# EasyEDA Pro project ProPrj_四串锂电池电源_2025-05-16.epro, board PCB1
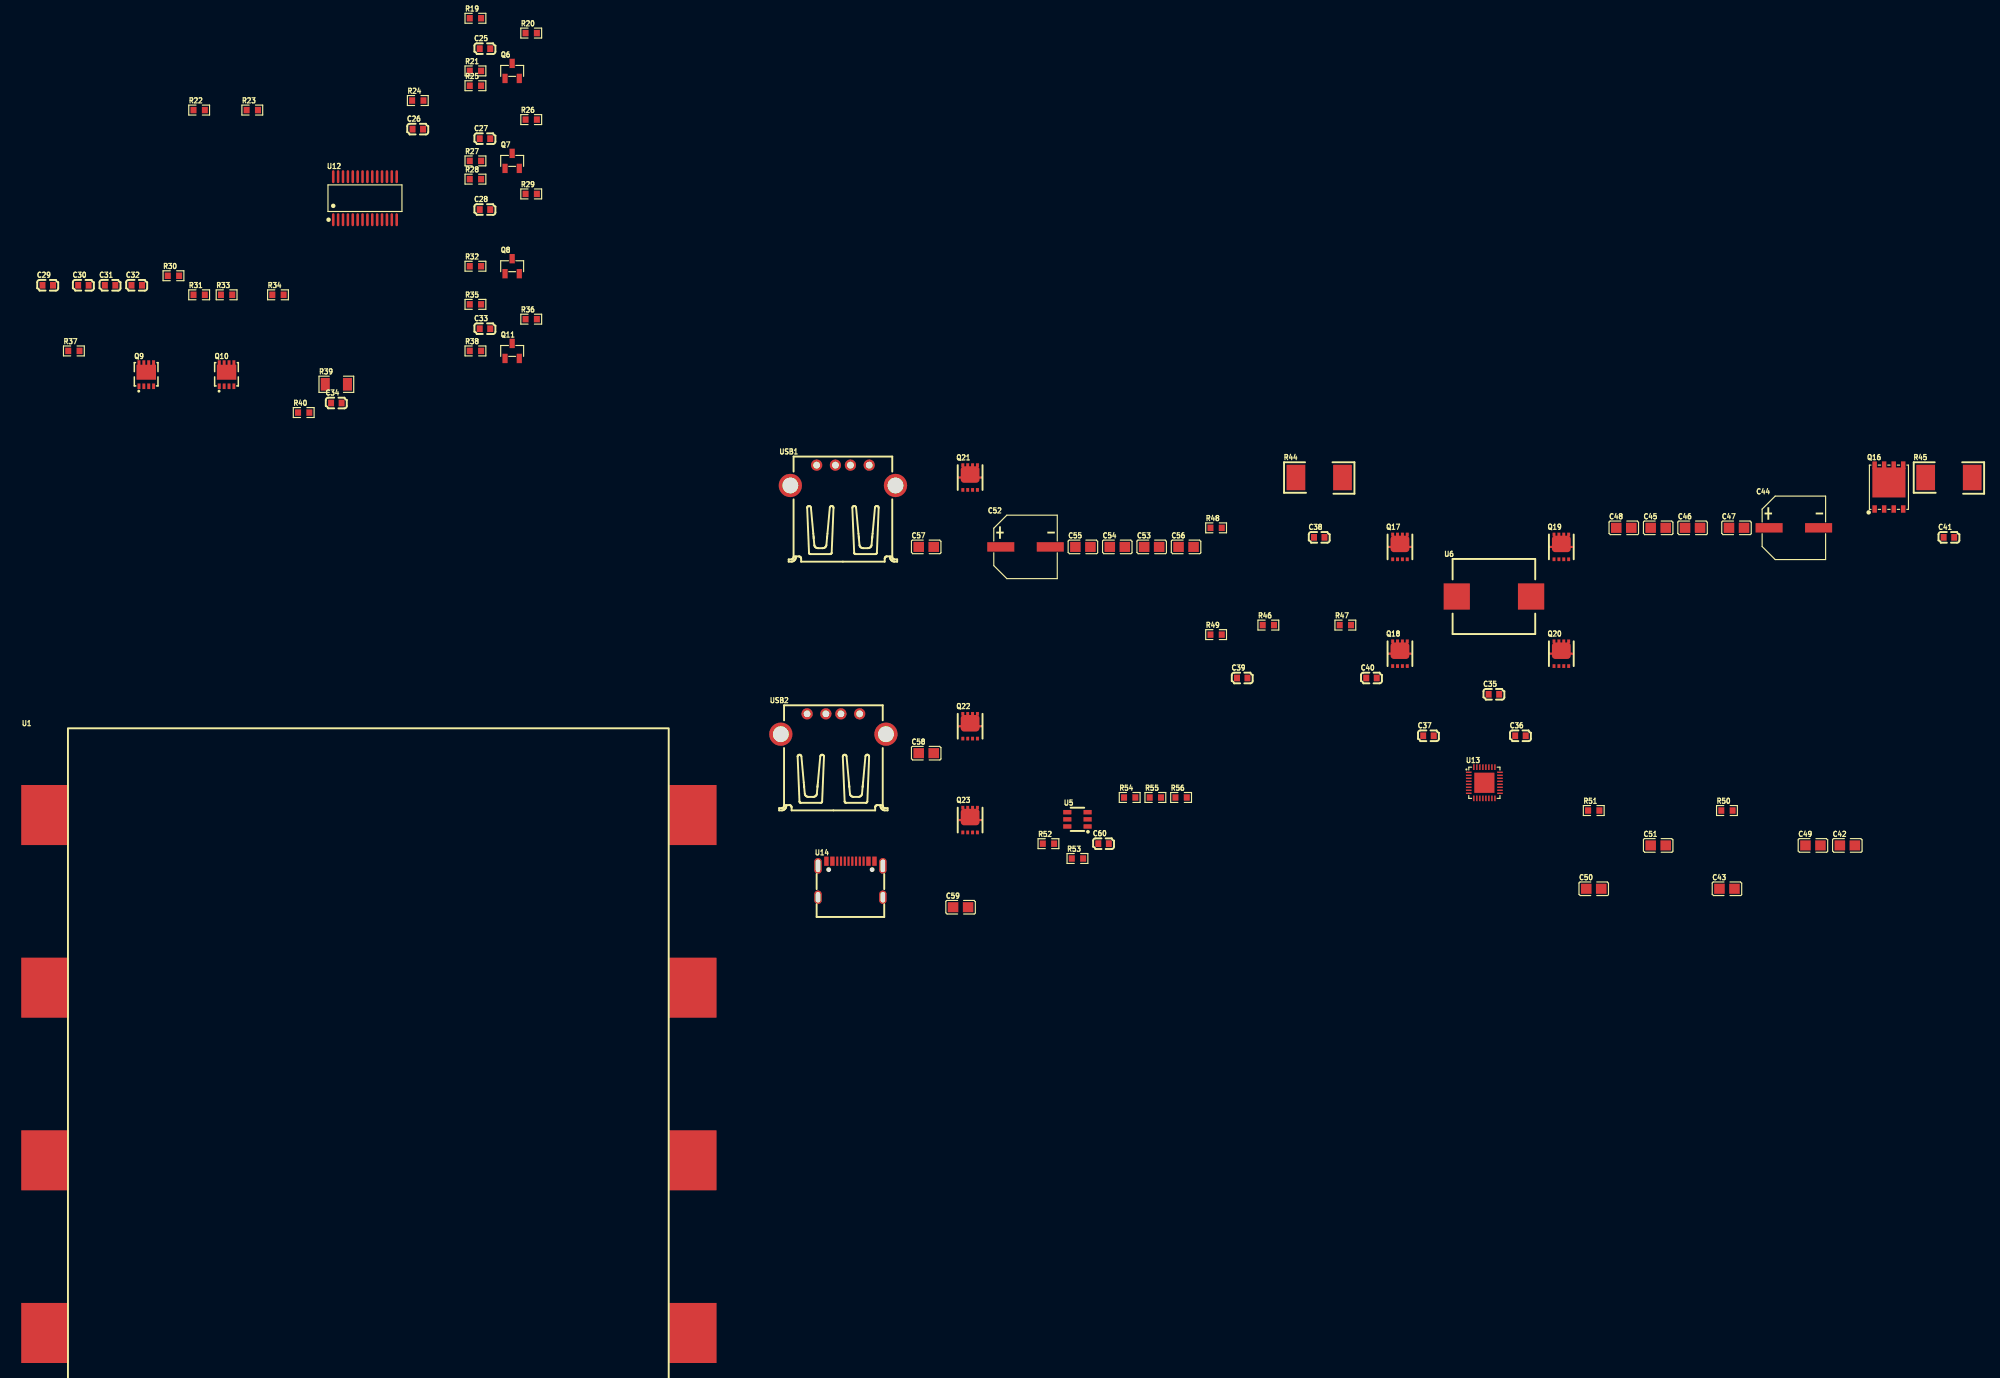
[diagram p8: board, top side]
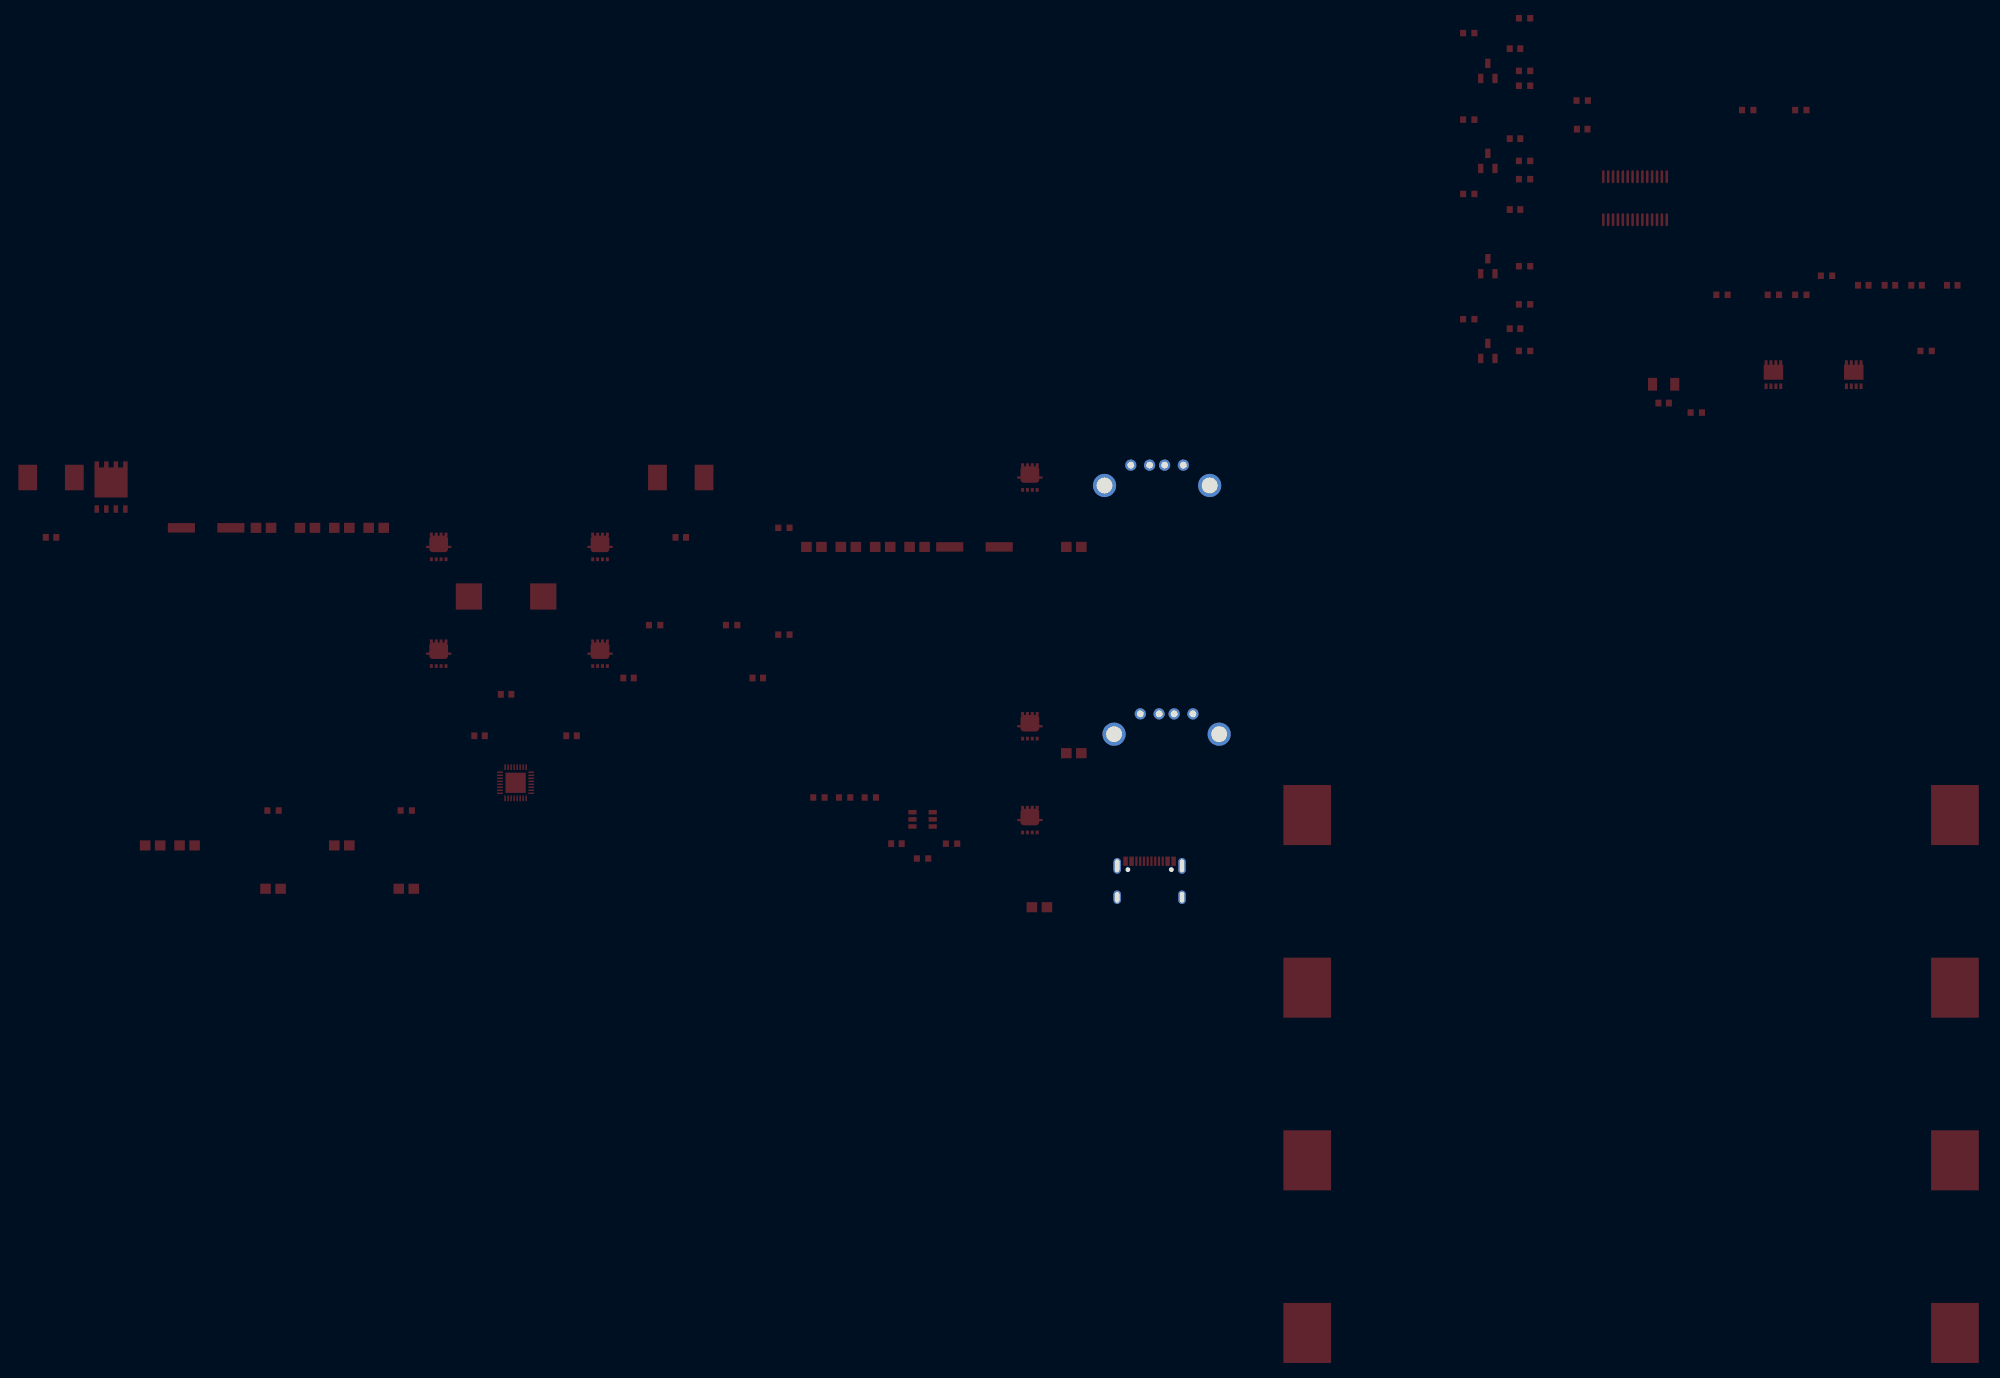
[diagram p9: board, bottom side, seen from below]

Outline 6.43 x 0.64 mm; copper layers: Top Layer, Bottom Layer. Coordinates in mm from the lower left corner of the outline.
Stack: Top Layer 0.035mm / Dielectric1 1.51mm FR4 er 4.5 / Bottom Layer 0.035mm

## Design rules (mm)
template: JLCPCB Capability(Two Layers Board)
spacing copperThickness1oz (default): track to track 0.102, other pairs 0.152 to 0.3
spacing copperThickness2oz: track to track 0.203, other pairs 0.152 to 0.3
track width copperThickness1oz (default): min 0.127, default 0.254, max 2.54
track width copperThickness2oz: min 0.203, default 0.254, max 2.54
differential pair differentialPair (default): width min 0.127, default 0.254, max 2.54; gap min 0.152, default 0.152
via viaSize (default): diameter min 0.5, default 0.61, max 10; hole min 0.3, default 0.305, max 6.3

## Placement (name value [footprint] x y rotation side)
C25  100nF  [C0603]  -45.44 109.69 0 top
C26  10uF  [C0603]  -54.39 98.97 0 top
C27  100nF  [C0603]  -45.44 97.7 0 top
C28  100nF  [C0603]  -45.44 88.26 0 top
C29  100nF  [C0603]  -103.67 78.17 0 top
C30  100nF  [C0603]  -98.92 78.17 0 top
C31  100nF  [C0603]  -95.37 78.17 0 top
C32  100nF  [C0603]  -91.82 78.17 0 top
C33  100nF  [C0603]  -45.44 72.39 0 top
C34  10nF  [C0603]  -65.23 62.48 0 top
C35  10uF  [C0603]  88.91 23.68 0 top
C36  100nF  [C0603]  92.45 18.15 0 top
C37  100nF  [C0603]  80.19 18.15 0 top
C38  100nF  [C0603]  65.65 44.59 0 top
C39  33nF  [C0603]  55.4 25.85 0 top
C40  33nF  [C0603]  72.61 25.85 0 top
C41  100nF  [C0603]  149.5 44.59 0 top
C42  10uF  [C0805]  135.97 3.54 0 top
C43  4.7nF  [C0805]  119.95 -2.23 0 top
C44  220uF  [CAP-SMD_BD8.0-L8.3-W8.3-LS9.0-FD]  128.86 45.86 0 top
C45  22uF  [C0805]  110.79 45.86 0 top
C46  22uF  [C0805]  115.37 45.86 0 top
C47  22uF  [C0805]  121.22 45.86 0 top
C48  22uF  [C0805]  106.21 45.86 0 top
C49  16pF  [C0805]  131.4 3.54 0 top
C50  4.7nF  [C0805]  102.21 -2.23 0 top
C51  8pF  [C0805]  110.79 3.54 0 top
C52  220uF  [CAP-SMD_BD8.0-L8.3-W8.3-LS9.0-FD]  26.54 43.32 0 top
C53  22uF  [C0805]  43.34 43.32 0 top
C54  22uF  [C0805]  38.76 43.32 0 top
C55  22uF  [C0805]  34.18 43.32 0 top
C56  22uF  [C0805]  47.92 43.32 0 top
C57  10uF  [C0805]  13.31 43.32 0 top
C58  10uF  [C0805]  13.31 15.84 0 top
C59  10uF  [C0805]  17.89 -4.69 0 top
C60  100nF  [C0603]  36.93 3.78 0 top
Q6  2N7002K  [SOT-23-3_L2.9-W1.3-P1.90-LS2.4-BL-1]  -41.82 106.73 0 top
Q7  2N7002K  [SOT-23-3_L2.9-W1.3-P1.90-LS2.4-BL-1]  -41.82 94.74 0 top
Q8  2N7002K  [SOT-23-3_L2.9-W1.3-P1.90-LS2.4-BL-1]  -41.82 80.71 0 top
Q9  RU3030M2  [PDFN3333-8_L3.1-W3.2-P0.65-LS3.4-BL]  -90.55 66.25 0 top
Q10  RU3030M2  [PDFN3333-8_L3.1-W3.2-P0.65-LS3.4-BL]  -79.85 66.25 0 top
Q11  2N7002K  [SOT-23-3_L2.9-W1.3-P1.90-LS2.4-BL-1]  -41.82 69.42 0 top
Q16  HY12P03C2  [DFN-8_L5.9-W5.2-P1.27-LS6.2-BL]  141.51 51.29 0 top
Q17  TPN2R703NL  [TSON3x3]  76.4 43.32 0 top
Q18  TPN2R703NL  [TSON3x3]  76.4 29.09 0 top
Q19  TPN2R703NL  [TSON3x3]  97.89 43.32 0 top
Q20  TPN2R703NL  [TSON3x3]  97.89 29.09 0 top
Q21  TPN2R703NL  [TSON3x3]  19.16 52.56 0 top
Q22  TPN2R703NL  [TSON3x3]  19.16 19.42 0 top
Q23  TPN2R703NL  [TSON3x3]  19.16 6.92 0 top
R19  470Ω  [R0603]  -46.71 113.74 0 top
R20  100Ω  [R0603]  -39.28 111.77 0 top
R21  1MΩ  [R0603]  -46.71 106.73 0 top
R22  1MΩ  [R0603]  -83.5 101.51 0 top
R23  1MΩ  [R0603]  -76.43 101.51 0 top
R24  470Ω  [R0603]  -54.39 102.78 0 top
R25  470Ω  [R0603]  -46.71 104.76 0 top
R26  100Ω  [R0603]  -39.28 100.24 0 top
R27  1MΩ  [R0603]  -46.71 94.74 0 top
R28  470Ω  [R0603]  -46.71 92.31 0 top
R29  100Ω  [R0603]  -39.28 90.34 0 top
R30  SDNT1608X103F3380FTF  [R0603]  -86.93 79.44 0 top
R31  6.98kΩ  [R0603]  -83.5 76.9 0 top
R32  1MΩ  [R0603]  -46.71 80.71 0 top
R33  47kΩ  [R0603]  -79.85 76.9 0 top
R34  470Ω  [R0603]  -73.01 76.9 0 top
R35  470Ω  [R0603]  -46.71 75.63 0 top
R36  100Ω  [R0603]  -39.28 73.66 0 top
R37  10MΩ  [R0603]  -100.19 69.42 0 top
R38  1MΩ  [R0603]  -46.71 69.42 0 top
R39  5mΩ  [R1206]  -65.23 64.98 0 top
R40  10MΩ  [R0603]  -69.58 61.21 0 top
R44  5mΩ  [RES-SMD_L6.4-W3.2-1]  65.65 52.56 0 top
R45  5mΩ  [RES-SMD_L6.4-W3.2-1]  149.5 52.56 0 top
R46  5R1  [R0603]  58.87 32.9 0 top
R47  5R1  [R0603]  69.13 32.9 0 top
R48  100K  [R0603]  51.92 45.86 0 top
R49  11K  [R0603]  51.92 31.63 0 top
R50  40K  [R0603]  119.95 8.19 0 top
R51  16K  [R0603]  102.21 8.19 0 top
R52  200K  [R0603]  29.59 3.78 0 top
R53  NC  [R0603]  33.45 1.8 0 top
R54  43K  [R0603]  40.41 9.93 0 top
R55  43K  [R0603]  43.83 9.93 0 top
R56  NTC3435 10K  [R0603]  47.25 9.93 0 top
U1  -  [21700四节电池仓]  -104.03 7.59 0 top
U5  ECP5701  [SOT-23-6_L2.9-W1.6-P0.95-LS2.8-BR]  33.45 7.02 0 top
U6  4.7uH  [IND-SMD_L11.0-W10.0]  88.91 36.71 0 top
U12  BM3451UNDC-T28A  [TSSOP-28_L9.7-W4.4-P0.65-LS6.4-BL]  -61.42 89.77 0 top
U13  SW7203  [QFN-32_L4.0-W4.0-P0.40-TL-EP2.7]  87.64 11.89 0 top
U14  GT-USB-7010ASV  [USB-C-SMD_G-SWITCH_GT-USB-7010ASV]  3.22 -0.96 0 top
USB1  -  [USB_ Type-A]  2.21 48.75 0 top
USB2  -  [USB_ Type-A]  0.94 15.61 0 top

## Footprints (pads in the part's own frame, mm; a bottom-side part is the same pattern mirrored in y, then rotated)
21700四节电池仓
  rect 6.35x8 smd: 1(0,0) 2(86.25,0) 3(0,-23) 4(86.25,-23) 5(0,-46) 6(86.25,-46) 7(0,-69) 8(86.25,-69)
C0603
  rect 0.8x0.9 smd: 1(-0.7,0) 2(0.7,0)
C0805
  rect 1.41x1.35 smd: 1(-1,0) 2(1,0)
CAP-SMD_BD8.0-L8.3-W8.3-LS9.0-FD
  rect 3.61x1.26 smd: 1(-3.295,0) 2(3.295,0)
DFN-8_L5.9-W5.2-P1.27-LS6.2-BL
  rect 0.6x1 smd: 1(-1.905,-2.925) 2(-0.635,-2.925) 3(0.635,-2.925) 4(1.905,-2.925) 5(1.905,2.925) 6(0.635,2.925) 7(-0.635,2.925) 8(-1.905,2.925)
  rect 4.41x4 smd: 9(0,0.61)
IND-SMD_L11.0-W10.0
  rect 3.5x3.5 smd: 1(-4.95,0) 2(4.95,0)
PDFN3333-8_L3.1-W3.2-P0.65-LS3.4-BL
  rect 0.4x0.75 smd: 1(-0.975,-1.534) 2(-0.325,-1.534) 3(0.325,-1.534) 4(0.975,-1.534)
  rect 0.4x0.8 smd: 5(0.975,1.534) 6(0.325,1.534) 7(-0.325,1.534) 8(-0.975,1.534)
  rect 2.6x2 smd: 9(-0.004,0.333)
QFN-32_L4.0-W4.0-P0.40-TL-EP2.7
  rect 0.76x0.2 smd: 1(-2.08,1.4) 2(-2.08,1) 3(-2.08,0.6) 4(-2.08,0.2) 5(-2.08,-0.2) 6(-2.08,-0.6) 7(-2.08,-1) 8(-2.08,-1.4) 17(2.08,-1.4) 18(2.08,-1) 19(2.08,-0.6) 20(2.08,-0.2) 21(2.08,0.2) 22(2.08,0.6) 23(2.08,1) 24(2.08,1.4)
  rect 0.2x0.76 smd: 9(-1.4,-2.08) 10(-1,-2.08) 11(-0.6,-2.08) 12(-0.2,-2.08) 13(0.2,-2.08) 14(0.6,-2.08) 15(1,-2.08) 16(1.4,-2.08) 25(1.4,2.08) 26(1,2.08) 27(0.6,2.08) 28(0.2,2.08) 29(-0.2,2.08) 30(-0.6,2.08) 31(-1,2.08) 32(-1.4,2.08)
  rect 2.7x2.7 smd: 33(0,0)
R0603
  rect 0.806x0.864 smd: 1(-0.753,0) 2(0.753,0)
R1206
  rect 1.208x1.701 smd: 1(-1.479,0) 2(1.479,0)
RES-SMD_L6.4-W3.2-1
  rect 2.5x3.4 smd: 1(-3.1,0) 2(3.1,0)
SOT-23-3_L2.9-W1.3-P1.90-LS2.4-BL-1
  rect 0.7x1.25 smd: 1(-0.95,-1) 2(0.95,-1) 3(0,1)
SOT-23-6_L2.9-W1.6-P0.95-LS2.8-BR
  rect 1.1x0.6 smd: 1(1.35,-0.95) 2(1.35,0) 3(1.35,0.95) 4(-1.35,0.95) 5(-1.35,0) 6(-1.35,-0.95)
TSON3x3
  rect 0.4x0.5 smd: 1(-0.975,1.65) 1(-0.325,1.65) 1(0.325,1.65) 1(0.975,1.65) 2(0.975,-1.65) 3(-0.975,-1.65) 3(-0.325,-1.65) 3(0.325,-1.65)
  rrect 2.5x2.2 smd: 1(0,0.4)
  rrect 3.4x0.3 smd: 1(0,0)
TSSOP-28_L9.7-W4.4-P0.65-LS6.4-BL
  oval 0.343x1.732 smd: 1(-4.225,-2.866) 2(-3.575,-2.866) 3(-2.925,-2.866) 4(-2.275,-2.866) 5(-1.625,-2.866) 6(-0.975,-2.866) 7(-0.325,-2.866) 8(0.325,-2.866) 9(0.975,-2.866) 10(1.625,-2.866) 11(2.275,-2.866) 12(2.925,-2.866) 13(3.575,-2.866) 14(4.225,-2.866) 15(4.225,2.866) 16(3.575,2.866) 17(2.925,2.866) 18(2.275,2.866) 19(1.625,2.866) 20(0.975,2.866) 21(0.325,2.866) 22(-0.325,2.866) 23(-0.975,2.866) 24(-1.625,2.866) 25(-2.275,2.866) 26(-2.925,2.866) 27(-3.575,2.866) 28(-4.225,2.866)
USB-C-SMD_G-SWITCH_GT-USB-7010ASV
  oval 1x2.1 hole 0.6x1.7: 1(-4.32,1.78) 2(4.32,1.78)
  oval 1x1.8 hole 0.6x1.4: 3(4.32,-2.4) 4(-4.32,-2.4)
  rect 0.6x1.24 smd: A1B12(-3.2,2.4) A4B9(-2.4,2.4) B1A12(3.2,2.4) B4A9(2.4,2.4)
  rect 0.3x1.24 smd: A5(-1.25,2.4) A6(-0.25,2.4) A7(0.25,2.4) A8(1.25,2.4) B5(1.75,2.4) B6(0.75,2.4) B7(-0.75,2.4) B8(-1.75,2.4)
USB_ Type-A
  round 1.5 hole 0.9: 1(-3.484,5.461) 2(-0.984,5.461) 3(1.016,5.461) 4(3.516,5.461)
  round 3.1 hole 2.1: SH1(7.016,2.751) SH2(-6.984,2.751)

## Nets
As in the schematic.

Pads without a net: U12 1 13 15 18; U14 1 2 3 4 A8 B8; USB1 2 3 SH1 SH2; USB2 2 3 SH1 SH2
